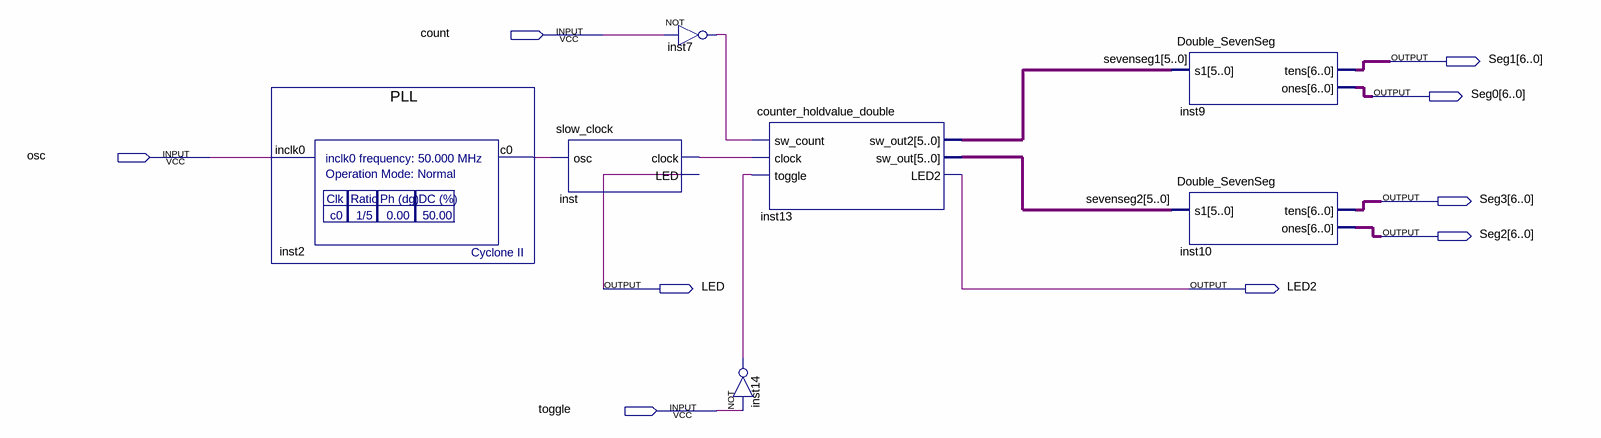
[diagram p0: schematic sheet]
// Quartus schematic 3rdExercise_doublecount.bdf as structural Verilog: 7 symbols, 9 pins
module \3rdExercise_doublecount  (
  input  count,
  input  osc,
  input  toggle,
  output [6:0] Seg1,
  output [6:0] Seg0,
  output [6:0] Seg3,
  output [6:0] Seg2,
  output LED,
  output LED2
);

  wire inst2_c0, inst7_out, inst14_out, inst_clock;
  wire [5:0] sevenseg1, sevenseg2;

  PLL inst2 (.inclk0(osc), .c0(inst2_c0));
  slow_clock inst (.osc(inst2_c0), .clock(inst_clock), .LED(LED));
  not inst7 (inst7_out, count);
  not inst14 (inst14_out, toggle);
  counter_holdvalue_double inst13 (
    .sw_count(inst7_out), .clock(inst_clock), .toggle(inst14_out), .sw_out2(sevenseg1), .sw_out(sevenseg2),
    .LED2(LED2));
  Double_SevenSeg inst9 (.s1(sevenseg1), .tens(Seg1), .ones(Seg0));
  Double_SevenSeg inst10 (.s1(sevenseg2), .tens(Seg3), .ones(Seg2));
endmodule
